# EAGLE design pcb1 (EAGLE 9.6.2)
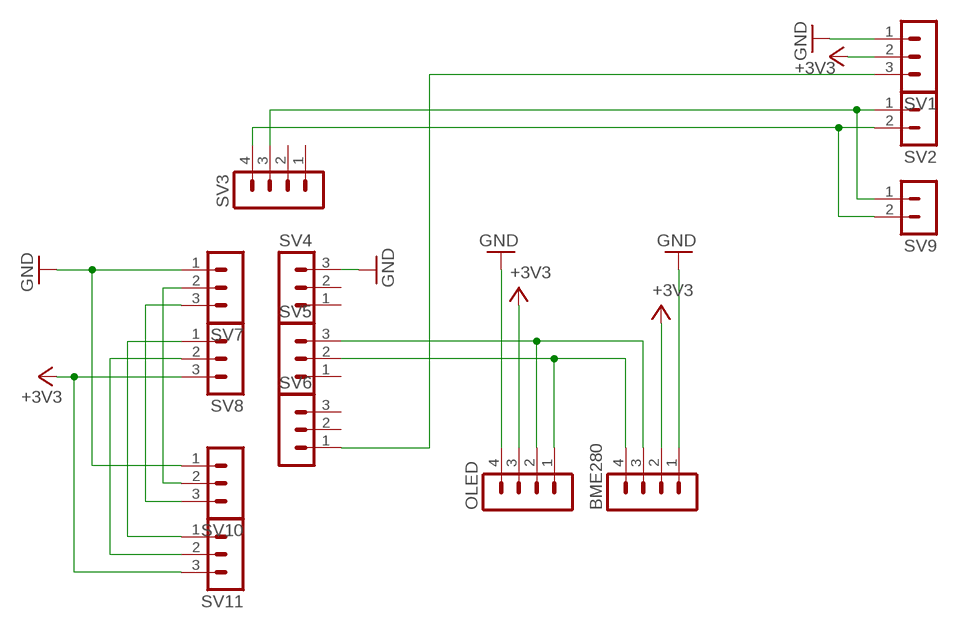
[diagram p0: schematic, sheet 1]

## Parts
BME280  PINHEAD-MA04-1  [PINHEAD-MA04-1]
OLED  PINHEAD-MA04-1  [PINHEAD-MA04-1]
SV1  PINHEAD-MA03-1  [PINHEAD-MA03-1]
SV2  PINHEAD-MA02-1  [PINHEAD-MA02-1]
SV3  PINHEAD-MA04-1  [PINHEAD-MA04-1]
SV4  PINHEAD-MA03-1  [PINHEAD-MA03-1]
SV5  PINHEAD-MA03-1  [PINHEAD-MA03-1]
SV6  PINHEAD-MA03-1  [PINHEAD-MA03-1]
SV7  PINHEAD-MA03-1  [PINHEAD-MA03-1]
SV8  PINHEAD-MA03-1  [PINHEAD-MA03-1]
SV9  PINHEAD-MA02-1  [PINHEAD-MA02-1]
SV10  PINHEAD-MA03-1  [PINHEAD-MA03-1]
SV11  PINHEAD-MA03-1  [PINHEAD-MA03-1]

## Nets
+3V3: BME280.2 OLED.3 SV1.2 SV8.3 SV11.3
GND: BME280.1 OLED.4 SV1.1 SV4.3 SV7.1 SV10.1
N$1: SV1.3 SV6.1
N$2: BME280.3 OLED.2 SV5.3
N$3: BME280.4 OLED.1 SV5.2
N$4: SV7.2 SV10.2
N$5: SV2.2 SV3.4 SV9.2
N$6: SV2.1 SV3.3 SV9.1
N$7: SV7.3 SV10.3
N$8: SV8.1 SV11.1
N$9: SV8.2 SV11.2
Unconnected: SV3.1 SV3.2 SV4.1 SV4.2 SV5.1 SV6.2 SV6.3

## Library data of the parts
BME280 OLED SV3 = ytani1:PINHEAD-MA04-1: PIN HEADER; OC_FARNELL: unknown; OC_NEWARK: unknown
SV1 SV4-SV8 SV10 SV11 = ytani1:PINHEAD-MA03-1: PIN HEADER; OC_FARNELL: unknown; OC_NEWARK: unknown
SV2 SV9 = ytani1:PINHEAD-MA02-1: PIN HEADER

## Board
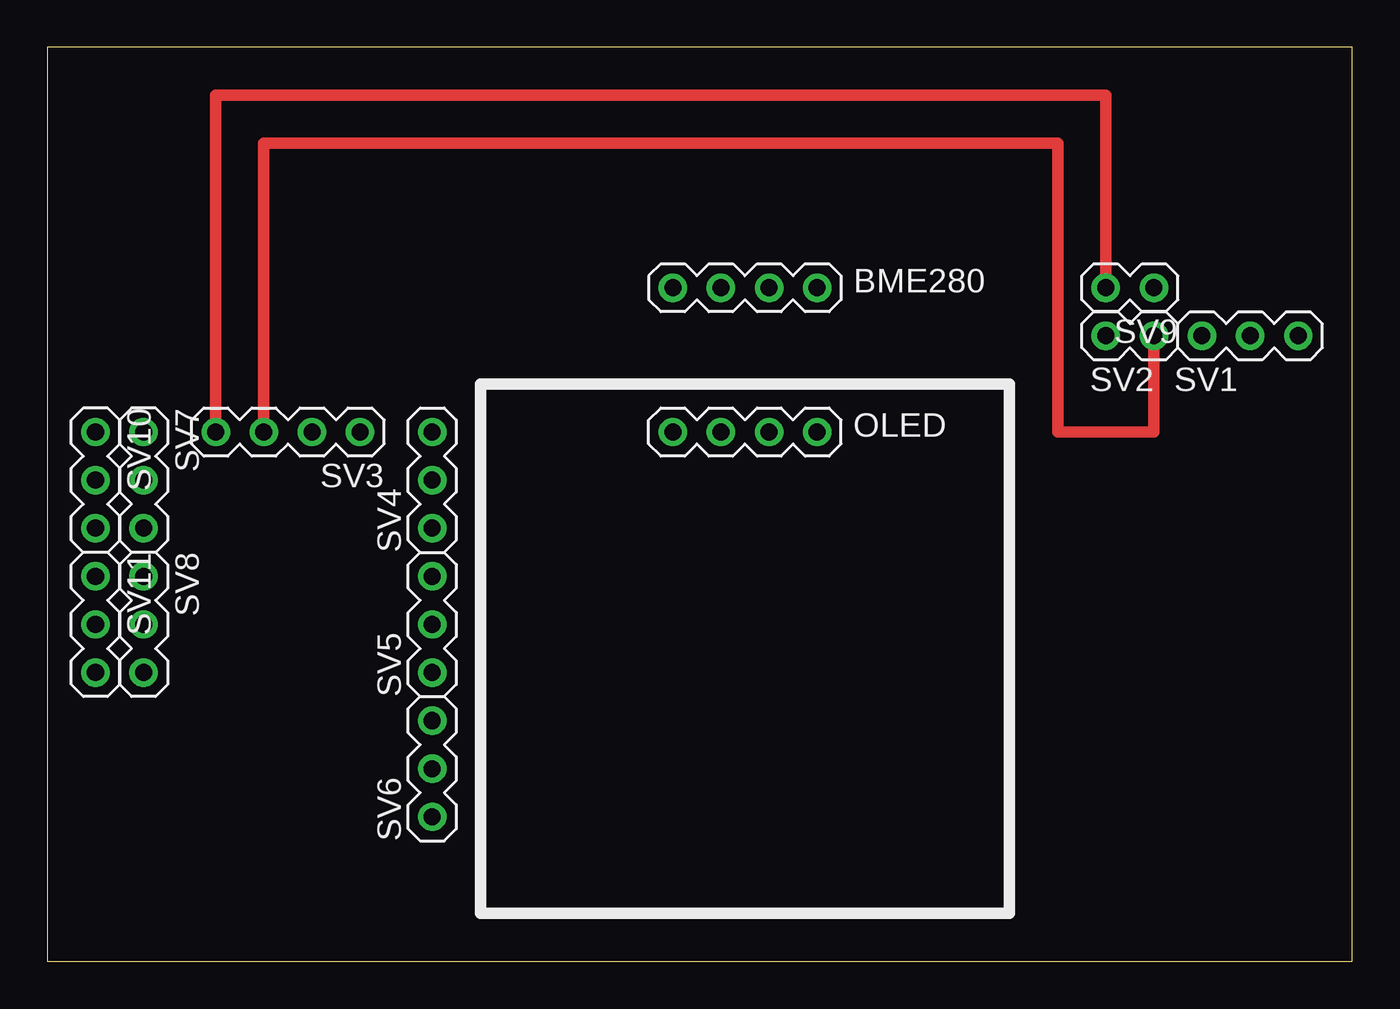
[diagram p1: board, top side]
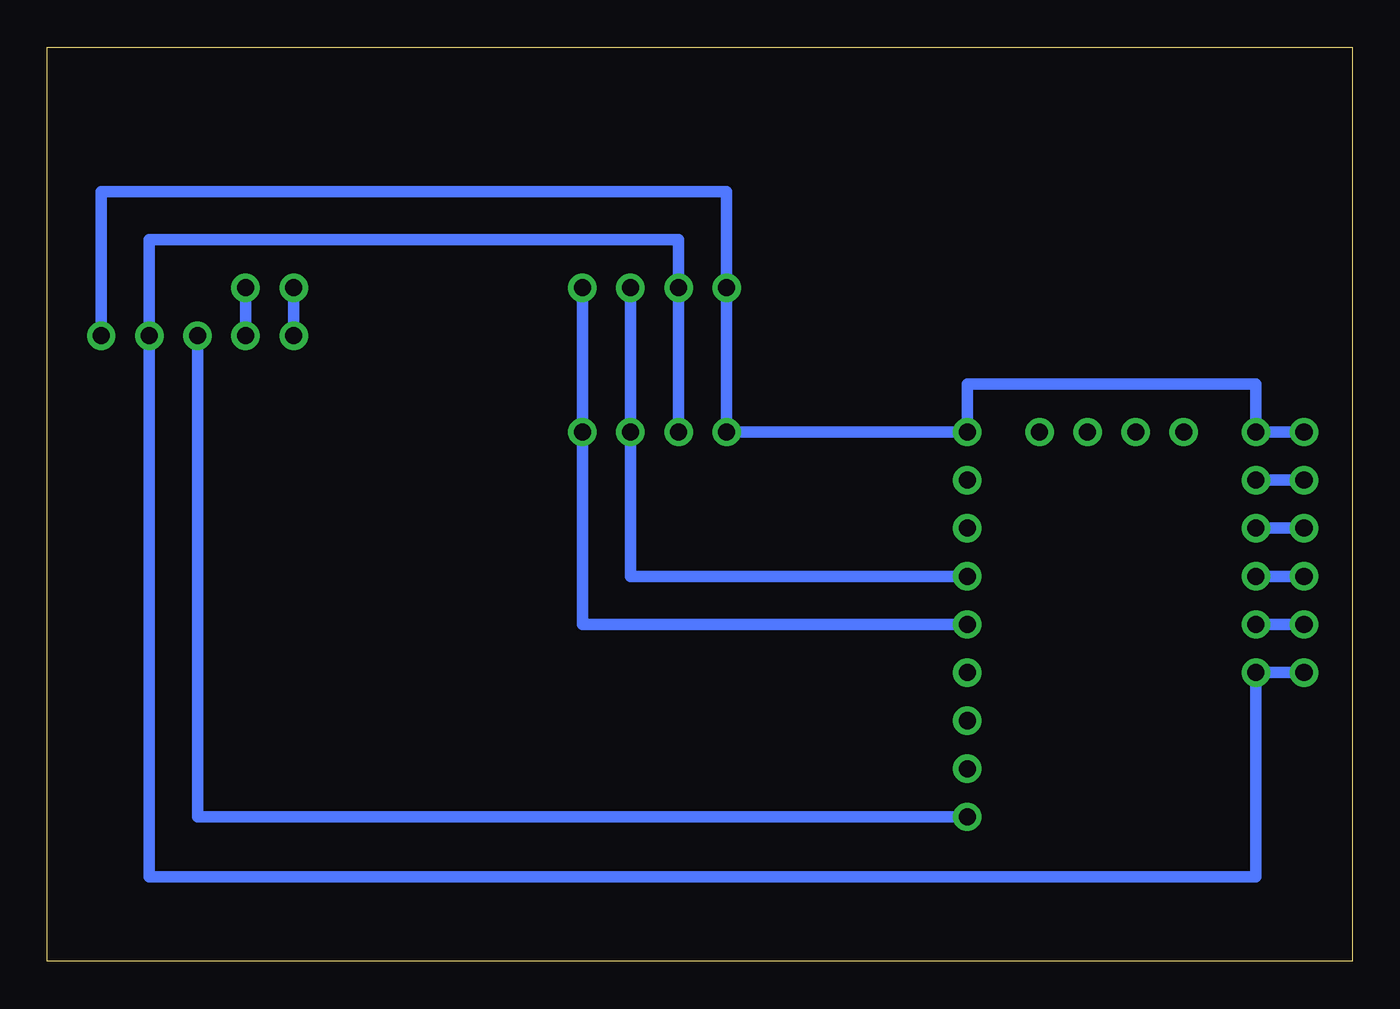
[diagram p2: board, bottom side, seen from below]

Size 68.89 x 48.25 mm. Coordinates in mm from the lower left corner, seen from the top.
Outline: 0,0 68.89,0 68.89,48.25 0,48.25 0,0
Copper layers (1*16): Top 0.035mm / dielectric 1.5mm / Bottom 0.035mm
Design rules "default": minimum track width 6mil, minimum drill 0.35mm, track to track 6mil, track to pad 6mil, pad to pad 6mil, via to via 6mil, smd to smd 6mil, copper to edge 40mil, drill to drill 6mil, minimum pad ring 10mil, minimum via ring 8mil, stop-mask expansion 4mil, vias tented up to drill 0mil, thermal gap 10mil

### Footprints (pad centres in the part's own frame; a part is rotated, then mirrored left to right if it is on the bottom)
PINHEAD-MA04-1 = drill 0.9 pad 1.5: 1 -3.81,0; 2 -1.27,0; 3 1.27,0; 4 3.81,0
PINHEAD-MA03-1 = drill 0.9 pad 1.5: 1 -1.27,0; 2 1.27,0; 3 3.81,0
PINHEAD-MA02-1 = drill 0.9 pad 1.5: 1 -1.27,0; 2 1.27,0

### Placement (x,y rotation side)
BME280  36.83,35.56 0 top
OLED  36.83,27.94 180 top
SV1  64.77,33.02 180 top
SV2  57.15,33.02 180 top
SV3  12.7,27.94 180 top
SV4  20.32,24.13 90 top
SV5  20.32,16.51 90 top
SV6  20.32,8.89 90 top
SV7  5.08,26.67 270 top
SV8  5.08,19.05 270 top
SV9  57.15,35.56 180 top
SV10  2.54,26.67 270 top
SV11  2.54,19.05 270 top

### Tracks (layer width: path | path; a pad name or v marks a point on that pad's centre or on a via)
+3V3
  Bottom 0.61: OLED.3 BME280.2 35.56,38.1 63.5,38.1 SV1.2 63.5,4.45 5.08,4.45 SV8.3 SV11.3
GND
  Bottom 0.61: SV1.1 66.04,40.64 33.02,40.64 BME280.1 OLED.4 SV4.3 20.32,30.48 5.08,30.48 SV7.1 SV10.1
N$1
  Bottom 0.61: SV1.3 60.96,7.62 SV6.1
N$2
  Bottom 0.61: BME280.3 OLED.2 38.1,20.32 SV5.3
N$3
  Bottom 0.61: BME280.4 OLED.1 40.64,17.78 SV5.2
N$4
  Bottom 0.61: SV7.2 SV10.2
N$5
  Top 0.61: SV3.4 8.89,45.72 55.88,45.72 SV9.2
  Bottom 0.61: SV2.2 SV9.2
N$6
  Top 0.61: SV3.3 11.43,43.18 53.34,43.18 53.34,27.94 58.42,27.94 SV2.1
  Bottom 0.61: SV2.1 SV9.1
N$7
  Bottom 0.61: SV7.3 SV10.3
N$8
  Bottom 0.61: SV8.1 SV11.1
N$9
  Bottom 0.61: SV8.2 SV11.2